# Altium schematic sheet 故指测试架主板.SchDoc
size A3
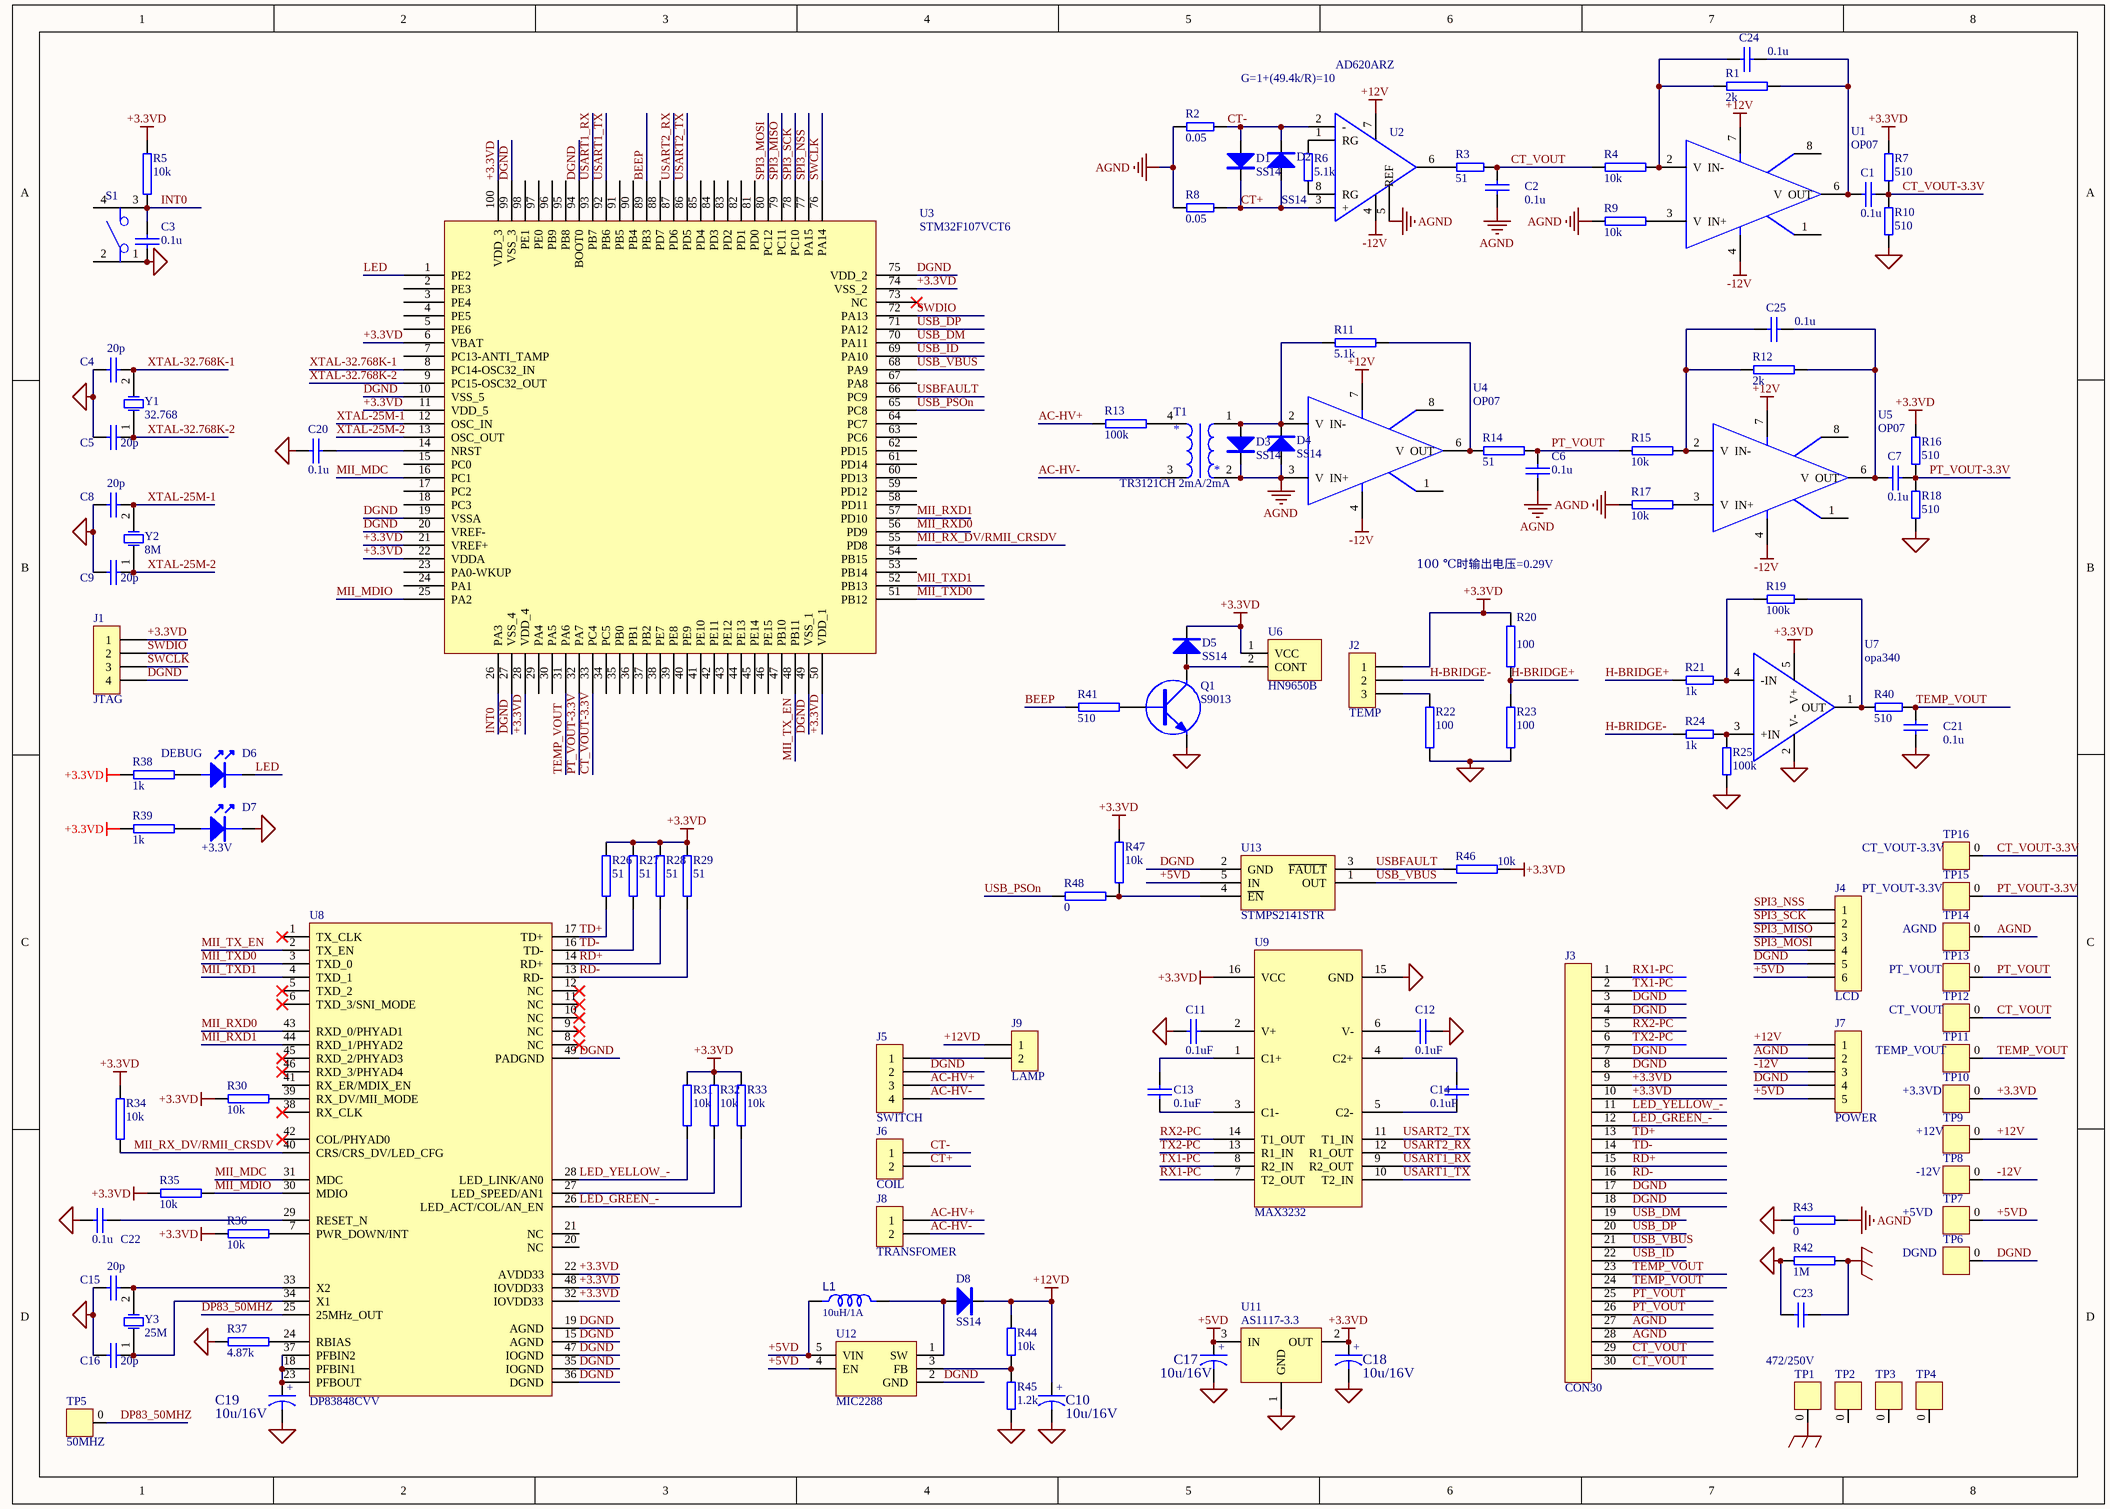
[diagram p0: 故指测试架主板.SchDoc]

## Parts
C1  0.1u  [0805]
C2  0.1u  [0805]
C3  0.1u  [0805]
C4  20p  [0805]
C5  20p  [0805]
C6  0.1u  [0805]
C7  0.1u  [0805]
C8  20p  [0805]
C9  20p  [0805]
C10  10u/16V  [1206C]
C11  0.1uF  [0805]
C12  0.1uF  [0805]
C13  0.1uF  [0805]
C14  0.1uF  [0805]
C15  20p  [0805]
C16  20p  [0805]
C17  10u/16V  [1206C]
C18  10u/16V  [1206C]
C19  10u/16V  [1206C]
C20  0.1u  [0805]
C21  0.1u  [0805]
C22  0.1u  [0805]
C23  472/250V  [RAD0.3]
C24  0.1u  [0805]
C25  0.1u  [0805]
D1  SS14  [SMA]
D2  SS14  [SMA]
D3  SS14  [SMA]
D4  SS14  [SMA]
D5  SS14  [SMA]
D6  DEBUG  [LED-0805]
D7  +3.3V  [LED-0805]
D8  SS14  [SMA]
J1  JTAG  [2510-4Y]
J2  TEMP  [KF2EDG3.81-3P]
J3  CON30  [IDC-30]
J4  LCD  [2510-6Y]
J5  SWITCH  [KF2EDG3.81-4P]
J6  COIL  [KF2EDG3.81-2P]
J7  POWER  [2510-5Y]
J8  TRANSFOMER  [KF2EDG3.81-2P]
J9  LAMP  [KF2EDG3.81-2P]
L1  10uH/1A  [1206]
Q1  S9013  [SOT-23]
R1  2k  [0805]
R2  0.05  [LVR03]
R3  51  [0805]
R4  10k  [0805]
R5  10k  [0805]
R6  5.1k  [0805]
R7  510  [0805]
R8  0.05  [LVR03]
R9  10k  [0805]
R10  510  [0805]
R11  5.1k  [0805]
R12  2k  [0805]
R13  100k  [2512]
R14  51  [0805]
R15  10k  [0805]
R16  510  [0805]
R17  10k  [0805]
R18  510  [0805]
R19  100k  [0805]
R20  100  [0805]
R21  1k  [0805]
R22  100  [0805]
R23  100  [0805]
R24  1k  [0805]
R25  100k  [0805]
R26  51  [0805]
R27  51  [0805]
R28  51  [0805]
R29  51  [0805]
R30  10k  [0805]
R31  10k  [0805]
R32  10k  [0805]
R33  10k  [0805]
R34  10k  [0805]
R35  10k  [0805]
R36  10k  [0805]
R37  4.87k  [0805]
R38  1k  [0805]
R39  1k  [0805]
R40  510  [0805]
R41  510  [0805]
R42  1M  [0805]
R43  0  [0805]
R44  10k  [0805]
R45  1.2k  [0805]
R46  10k  [0805]
R47  10k  [0805]
R48  0  [0805]
S1  (no value)  [B3F-4055]
T1  TR3121CH 2mA/2mA  [TR3121CH]
TP1  (no value)  [PAD4.5]
TP2  (no value)  [PAD4.5]
TP3  (no value)  [PAD4.5]
TP4  (no value)  [PAD4.5]
TP5  50MHZ  [TESTPOINT]
TP6  DGND  [TESTPOINT]
TP7  +5VD  [TESTPOINT]
TP8  -12V  [TESTPOINT]
TP9  +12V  [TESTPOINT]
TP10  +3.3VD  [TESTPOINT]
TP11  TEMP_VOUT  [TESTPOINT]
TP12  CT_VOUT  [TESTPOINT]
TP13  PT_VOUT  [TESTPOINT]
TP14  AGND  [TESTPOINT]
TP15  PT_VOUT-3.3V  [TESTPOINT]
TP16  CT_VOUT-3.3V  [TESTPOINT]
U1  OP07  [SO-8]
U2  AD620ARZ  [SO-8]
U3  STM32F107VCT6  [LQFP100_L]
U4  OP07  [SO-8]
U5  OP07  [SO-8]
U6  HN9650B  [HN9650B]
U7  opa340  [SOT23-5]
U8  DP83848CVV  [DP83848]
U9  MAX3232  [SO-16]
U11  AS1117-3.3  [SOT-223]
U12  MIC2288  [SOT23-5]
U13  STMPS2141STR  [SOT23-5]
Y1  32.768  [XTAL-5032]
Y2  8M  [XTAL-5032]
Y3  25M  [XTAL-5032]

## Nets
+3.3VD: C18.1 D5.2 J1.1 J2.1 J3.9 J3.10 R5.1 R7.1 R16.1 R20.2 R26.2 R27.2 R28.2 R29.2 R30.1 R31.2 R32.2 R33.2 R34.1 R35.2 R36.1 R38.2 R39.2 R46.2 R47.1 TP10.0 U3.6(VBAT) U3.11(VDD_5) U3.21(VREF+) U3.22(VDDA) U3.28(VDD_4) U3.50(VDD_1) U3.74(VSS_2) U3.100(VDD_3) U6.1(VCC) U7.5(V+) U8.22(AVDD33) U8.32(IOVDD33) U8.48(IOVDD33) U9.16(VCC) U11.2(OUT)
+5VD: C17.1 J4.6 J7.5 L1.1 TP7.0 U11.3(IN) U12.4(EN) U12.5(VIN) U13.5(IN)
+12V: J7.1 TP9.0 U1.7(VDD) U2.7(V+) U4.7(VDD) U5.7(VDD)
+12VD: C10.1 D8.2 J9.1 R44.1
-12V: J7.3 TP8.0 U1.4(VSS) U2.4(V-) U4.4(VSS) U5.4(VSS)
AGND: C2.1 C6.1 D3.2 D4.1 J3.27 J3.28 J7.2 R2.2 R8.2 R9.1 R17.1 R43.1 T1.2 TP14.0 U2.5(REF) U4.3(V__IN+)
DGND: C3.2 C4.2 C5.2 C8.2 C9.2 C10.2 C11.2 C12.2 C15.2 C16.2 C17.2 C18.2 C19.2 C20.1 C21.1 C22.1 C23.2 D7.2(K) J1.4 J3.3 J3.4 J3.7 J3.8 J3.17 J3.18 J4.5 J5.2 J7.4 Q1.2(E) R10.2 R18.2 R22.1 R23.1 R25.2 R37.1 R42.2 R43.2 R45.2 S1.1 TP6.0 U3.10(VSS_5) U3.19(VSSA) U3.20(VREF-) U3.27(VSS_4) U3.49(VSS_1) U3.75(VDD_2) U3.94(BOOT0) U3.99(VSS_3) U7.2(V-) U8.15(AGND) U8.19(AGND) U8.35(IOGND) U8.36(DGND) U8.47(IOGND) U8.49(PADGND) U9.15(GND) U11.1(GND) U12.2(GND) U13.2(GND)
PE: C23.1 R42.1 TP1.0
AC-HV+: J5.3 J8.1 R13.1
AC-HV-: J5.4 J8.2 T1.3
BEEP: R41.2 U3.89(PB3)
CT+: D1.2 D2.1 J6.2 R8.1 U2.3(+)
CT-: D1.1 D2.2 J6.1 R2.1 U2.2(-)
CT_VOUT: C2.2 J3.29 J3.30 R3.1 R4.1 TP12.0
CT_VOUT-3.3V: C1.1 R7.2 R10.1 TP16.0 U3.33(PC4)
DP83_50MHZ: TP5.0 U8.25(25MHz_OUT)
H-BRIDGE+: R20.1 R21.2 R23.2
H-BRIDGE-: J2.2 R24.2
INT0: C3.1 R5.2 S1.3 U3.26(PA3)
LED: D6.2(K) U3.1(PE2)
LED_GREEN_-: J3.12 R33.1 U8.26(LED_ACT/COL/AN_EN)
LED_YELLOW_-: J3.11 R31.1 U8.28(LED_LINK/AN0)
MII_MDC: U3.16(PC1) U8.31(MDC)
MII_MDIO: R35.1 U3.25(PA2) U8.30(MDIO)
MII_RX_DV/RMII_CRSDV: R34.2 U3.55(PD8) U8.40(CRS/CRS_DV/LED_CFG)
MII_RXD0: U3.56(PD9) U8.43(RXD_0/PHYAD1)
MII_RXD1: U3.57(PD10) U8.44(RXD_1/PHYAD2)
MII_TX_EN: U3.48(PB11) U8.2(TX_EN)
MII_TXD0: U3.51(PB12) U8.3(TXD_0)
MII_TXD1: U3.52(PB13) U8.4(TXD_1)
PT_VOUT: C6.2 J3.25 J3.26 R14.2 R15.1 TP13.0
PT_VOUT-3.3V: C7.1 R16.2 R18.1 TP15.0 U3.32(PA7)
RD+: J3.15 R28.1 U8.14(RD+)
RD-: J3.16 R29.1 U8.13(RD-)
RX1-PC: J3.1 U9.7(T2_OUT)
RX2-PC: J3.5 U9.14(T1_OUT)
SPI3_MISO: J4.3 U3.79(PC11)
SPI3_MOSI: J4.4 U3.80(PC12)
SPI3_NSS: J4.1 U3.77(PA15)
SPI3_SCK: J4.2 U3.78(PC10)
SWCLK: J1.3 U3.76(PA14)
SWDIO: J1.2 U3.72(PA13)
TD+: J3.13 R26.1 U8.17(TD+)
TD-: J3.14 R27.1 U8.16(TD-)
TEMP_VOUT: C21.2 J3.23 J3.24 R40.1 TP11.0 U3.31(PA6)
TX1-PC: J3.2 U9.8(R2_IN)
TX2-PC: J3.6 U9.13(R1_IN)
USART1_RX: U3.93(PB7) U9.9(R2_OUT)
USART1_TX: U3.92(PB6) U9.10(T2_IN)
USART2_RX: U3.87(PD6) U9.12(R1_OUT)
USART2_TX: U3.86(PD5) U9.11(T1_IN)
USB_DM: J3.19 U3.70(PA11)
USB_DP: J3.20 U3.71(PA12)
USB_ID: J3.22 U3.69(PA10)
USB_PSOn: R48.1 U3.65(PC8)
USB_VBUS: J3.21 U3.68(PA9) U13.1(OUT)
USBFAULT: R46.1 U3.66(PC9) U13.3(~{FAULT})
XTAL-25M-1: C8.1 U3.12(OSC_IN) Y2.2(OSC2)
XTAL-25M-2: C9.1 U3.13(OSC_OUT) Y2.1(OSC1)
XTAL-32.768K-1: C4.1 U3.8(PC14-OSC32_IN) Y1.2(OSC2)
XTAL-32.768K-2: C5.1 U3.9(PC15-OSC32_OUT) Y1.1(OSC1)
NetC1_2: C1.2 C24.1 R1.2 U1.6(V__OUT)
NetC7_2: C7.2 C25.1 R12.2 U5.6(V__OUT)
NetC11_1: C11.1 U9.2(V+)
NetC12_1: C12.1 U9.6(V-)
NetC13_1: C13.1 U9.1(C1+)
NetC13_2: C13.2 U9.3(C1-)
NetC14_1: C14.1 U9.4(C2+)
NetC14_2: C14.2 U9.5(C2-)
NetC15_1: C15.1 U8.33(X2) Y3.2(OSC2)
NetC16_1: C16.1 U8.34(X1) Y3.1(OSC1)
NetC19_1: C19.1 U8.18(PFBIN1) U8.23(PFBOUT) U8.37(PFBIN2)
NetC20_2: C20.2 U3.14(NRST)
NetC22_2: C22.2 U8.29(RESET_N)
NetC24_2: C24.2 R1.1 R4.2 U1.2(V__IN-)
NetC25_2: C25.2 R12.1 R15.2 U5.2(V__IN-)
NetD3_1: D3.1 D4.2 R11.1 T1.1 U4.2(V__IN-)
NetD5_1: D5.1 Q1.3(C) U6.2(CONT)
NetD6_1: D6.1(A) R38.1
NetD7_1: D7.1(A) R39.1
NetD8_1: D8.1 L1.2 U12.1(SW)
NetJ2_3: J2.3 R22.2
NetJ5_1: J5.1 J9.2
NetQ1_1: Q1.1(B) R41.1
NetR3_2: R3.2 U2.6(OUT)
NetR6_1: R6.1 U2.8(RG)
NetR6_2: R6.2 U2.1(RG)
NetR9_2: R9.2 U1.3(V__IN+)
NetR11_2: R11.2 R14.1 U4.6(V__OUT)
NetR13_2: R13.2 T1.4
NetR17_2: R17.2 U5.3(V__IN+)
NetR19_1: R19.1 R21.1 U7.4(-IN)
NetR19_2: R19.2 R40.2 U7.1(OUT)
NetR24_1: R24.1 R25.1 U7.3(+IN)
NetR30_2: R30.2 U8.39(RX_DV/MII_MODE)
NetR32_1: R32.1 U8.27(LED_SPEED/AN1)
NetR36_2: R36.2 U8.7(PWR_DOWN/INT)
NetR37_2: R37.2 U8.24(RBIAS)
NetR44_2: R44.2 R45.1 U12.3(FB)
NetR47_2: R47.2 R48.2 U13.4(~{EN})

Not connected (* = marked no-connect by the designer): S1 2 4; TP2 0; TP3 0; TP4 0; U1 1(VOSTRIM) 8(VOSTRIM); U3 2(PE3) 3(PE4) 4(PE5) 5(PE6) 7(PC13-ANTI_TAMP) 15(PC0) 17(PC2) 18(PC3) 23(PA0-WKUP) 24(PA1) 29(PA4) 30(PA5) 34(PC5) 35(PB0) 36(PB1) 37(PB2) 38(PE7) 39(PE8) 40(PE9) 41(PE10) 42(PE11) 43(PE12) 44(PE13) 45(PE14) 46(PE15) 47(PB10) 53(PB14) 54(PB15) 58(PD11) 59(PD12) 60(PD13) 61(PD14) 62(PD15) 63(PC6) 64(PC7) 67(PA8) 73(NC)* 81(PD0) 82(PD1) 83(PD2) 84(PD3) 85(PD4) 88(PD7) 90(PB4) 91(PB5) 95(PB8) 96(PB9) 97(PE0) 98(PE1); U4 1(VOSTRIM) 8(VOSTRIM); U5 1(VOSTRIM) 8(VOSTRIM); U8 1(TX_CLK)* 5(TXD_2)* 6(TXD_3/SNI_MODE)* 8(NC)* 9(NC)* 10(NC)* 11(NC)* 12(NC)* 20(NC) 21(NC) 38(RX_CLK)* 41(RX_ER/MDIX_EN) 42(COL/PHYAD0)* 45(RXD_2/PHYAD3)* 46(RXD_3/PHYAD4)*

## Notes on the sheet
- G=1+(49.4k/R)=10
- 100 ℃时输出电压=0.29V
- Title
- Size:
- Date:
- A3
- Number:
- Time:
- Revision:
- Sheet
- of
- File:
- (in symbol CAPACITOR POL) +

## Library data of the parts
C1-C9 C11-C16 C20-C25 = CAP: Capacitor
C10 C17-C19 = CAPACITOR POL: Capacitor
D1-D5 D8 = SS14: Diode
D6 D7 = LED-0805
J1 J5 = CON4: Connector
J2 = CON3: Connector
J4 = CON6
J6 J8 J9 = CON2: Connector
J7 = CON5
L1 = INDUCTOR_1: Part Field 1: D3132005710501
R1 R4 R5 R9 R11-R15 R17 R20 R22 R23 R26-R39 R41-R43 R46-R48 = R
R2 R3 R6-R8 R10 R16 R18 R19 R21 R24 R25 R40 R44 R45 = 电阻
S1 = B3F-4055
TP1-TP16 = TESTPT
U1 U4 U5 = OP07CS: Ultra-Low Offset Voltage Operational Amplifier
U2 = AD620AN: Low-Cost, Low-Power Instrumentation Amplifier
Y1-Y3 = XTAL: Crystal Oscillator; Published: 8-Jun-2000; LatestRevisionDate: 17-Jul-2002; LatestRevisionNote: Re-released for DXP Platform.; PackageReference: R38; Publisher: Altium Limited